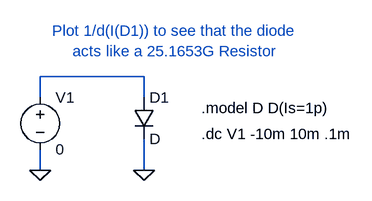
[diagram p0: schematic DiodeSim1.asc]
DiodeSim1.asc, the LTspice schematic file:
Version 4
SHEET 1 976 680
WIRE 80 -128 -80 -128
WIRE -80 -96 -80 -128
WIRE 80 -96 80 -128
WIRE -80 16 -80 -16
WIRE 80 16 80 -32
FLAG -80 16 0
FLAG 80 16 0
SYMBOL diode 64 -96 R0
SYMATTR InstName D1
SYMBOL voltage -80 -112 R0
SYMATTR InstName V1
SYMATTR Value 0
TEXT 168 -80 Left 0 !.model D D(Is=1p)
TEXT 168 -40 Left 0 !.dc V1 -10m 10m .1m
TEXT 128 -152 Bottom 0 ;Plot 1/d(I(D1)) to see that the diode\nacts like a 25.1653G Resistor

The netlist it stands for:
* DiodeSim1.asc
D1 N001 0 D
V1 N001 0 0
.model D D
.lib standard.dio
.model D D(Is=1p)
.dc V1 -10m 10m .1m
* Plot 1/d(I(D1)) to see that the diode
* acts like a 25.1653G Resistor
.backanno
.end